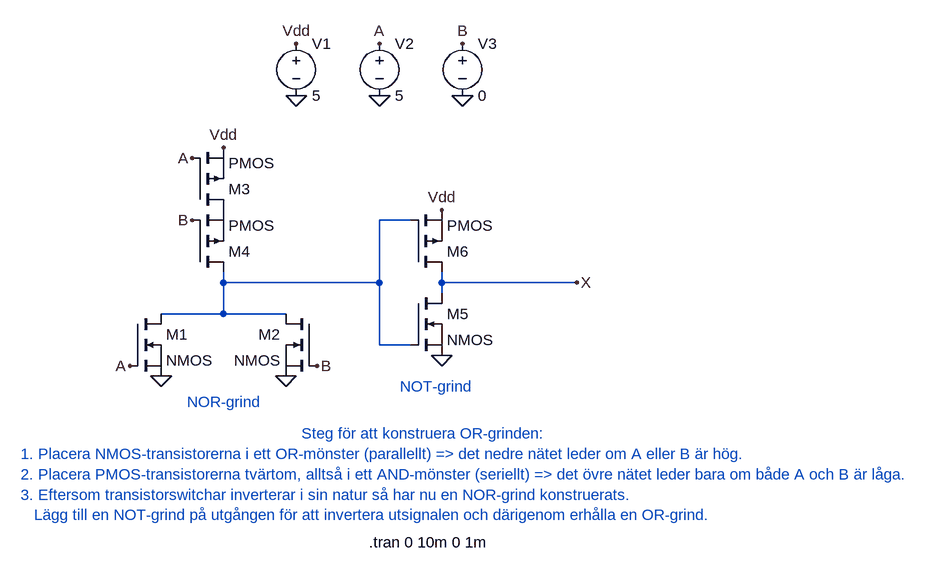
[diagram p0: schematic or_gate.asc]
or_gate.asc, the LTspice schematic file:
Version 4
SHEET 1 2084 896
WIRE 512 336 464 336
WIRE 224 432 224 416
WIRE 464 432 464 336
WIRE 464 432 224 432
WIRE 560 432 560 416
WIRE 768 432 560 432
WIRE 560 448 560 432
WIRE 224 480 224 432
WIRE 224 480 128 480
WIRE 320 480 224 480
WIRE 464 528 464 432
WIRE 512 528 464 528
FLAG 336 144 0
FLAG 464 144 0
FLAG 592 144 0
FLAG 336 64 Vdd
FLAG 464 64 A
FLAG 592 64 B
FLAG 128 576 0
FLAG 320 576 0
FLAG 224 224 Vdd
FLAG 80 560 A
FLAG 176 240 A
FLAG 368 560 B
FLAG 176 336 B
FLAG 560 320 Vdd
FLAG 560 544 0
FLAG 768 432 X
SYMBOL voltage 336 48 R0
WINDOW 123 0 0 Left 0
WINDOW 39 0 0 Left 0
SYMATTR InstName V1
SYMATTR Value 5
SYMBOL voltage 464 48 R0
WINDOW 123 0 0 Left 0
WINDOW 39 0 0 Left 0
SYMATTR InstName V2
SYMATTR Value 5
SYMBOL voltage 592 48 R0
WINDOW 123 0 0 Left 0
WINDOW 39 0 0 Left 0
SYMATTR InstName V3
SYMATTR Value 0
SYMBOL nmos 80 480 R0
SYMATTR InstName M1
SYMBOL nmos 368 480 M0
SYMATTR InstName M2
SYMBOL pmos 176 320 M180
SYMATTR InstName M3
SYMBOL pmos 176 416 M180
SYMATTR InstName M4
SYMBOL nmos 512 448 R0
SYMATTR InstName M5
SYMBOL pmos 512 416 M180
SYMATTR InstName M6
TEXT 168 616 Left 2 ;NOR-grind
TEXT 448 832 Left 2 !.tran 0 10m 0 1m
TEXT 496 592 Left 2 ;NOT-grind
TEXT -88 696 Left 2 ;1. Placera NMOS-transistorerna i ett OR-mönster (parallellt) => det nedre nätet leder om A eller B är hög.\n2. Placera PMOS-transistorerna tvärtom, alltså i ett AND-mönster (seriellt) => det övre nätet leder bara om både A och B är låga.\n3. Eftersom transistorswitchar inverterar i sin natur så har nu en NOR-grind konstruerats. \n   Lägg till en NOT-grind på utgången för att invertera utsignalen och därigenom erhålla en OR-grind.
TEXT 344 664 Left 2 ;Steg för att konstruera OR-grinden:

The netlist it stands for:
* or_gate.asc
V1 Vdd 0 5
V2 A 0 5
V3 B 0 0
M1 N001 A 0 0 NMOS
M2 N001 B 0 0 NMOS
M3 P001 A Vdd Vdd PMOS
M4 N001 B P001 P001 PMOS
M5 X N001 0 0 NMOS
M6 X N001 Vdd Vdd PMOS
.model NMOS NMOS
.model PMOS PMOS
.lib standard.mos
* NOR-grind
.tran 0 10m 0 1m
* NOT-grind
* 1. Placera NMOS-transistorerna i ett OR-mönster (parallellt) => det nedre nätet leder om A eller B är hög.
* 2. Placera PMOS-transistorerna tvärtom, alltså i ett AND-mönster (seriellt) => det övre nätet leder bara om både A och B är låga.
* 3. Eftersom transistorswitchar inverterar i sin natur så har nu en NOR-grind konstruerats.
*    Lägg till en NOT-grind på utgången för att invertera utsignalen och därigenom erhålla en OR-grind.
* Steg för att konstruera OR-grinden:
.backanno
.end